# Altium schematic sheet HEATER.SchDoc: HEATER
size 420 x 297 mm; SheetNumber: 8; SheetTotal: 12
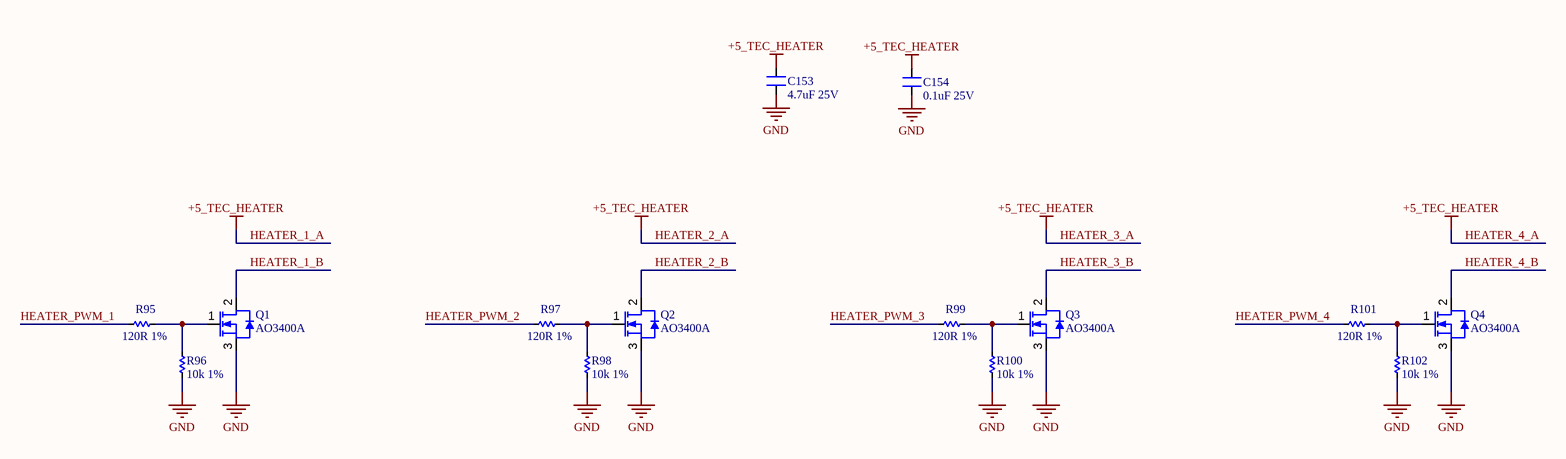
[diagram p0: HEATER.SchDoc]

## Parts
C153  4.7uF 25V  [CN-SMD-0603-EXP-V101]
C154  0.1uF 25V  [CN-SMD-0603-EXP-V101]
Q1  AO3400A  [SOT23-13_2]
Q2  AO3400A  [SOT23-13_2]
Q3  AO3400A  [SOT23-13_2]
Q4  AO3400A  [SOT23-13_2]
R95  120R 1%  [RES-SMD-0603-EXP-V101]
R96  10k 1%  [RES-SMD-0603-EXP-V101]
R97  120R 1%  [RES-SMD-0603-EXP-V101]
R98  10k 1%  [RES-SMD-0603-EXP-V101]
R99  120R 1%  [RES-SMD-0603-EXP-V101]
R100  10k 1%  [RES-SMD-0603-EXP-V101]
R101  120R 1%  [RES-SMD-0603-EXP-V101]
R102  10k 1%  [RES-SMD-0603-EXP-V101]

## Nets
GND: C153.1 C154.1 Q1.3(S) Q2.3(S) Q3.3(S) Q4.3(S) R96.1 R98.1 R100.1 R102.1
HEATER_1_A: C153.2 C154.2  [also labelled +5_TEC_HEATER, HEATER_2_A, HEATER_3_A, HEATER_4_A]
HEATER_1_B: Q1.2(D)
HEATER_2_B: Q2.2(D)
HEATER_3_B: Q3.2(D)
HEATER_4_B: Q4.2(D)
HEATER_PWM_1: R95.1
HEATER_PWM_2: R97.1
HEATER_PWM_3: R99.1
HEATER_PWM_4: R101.1
NetQ1_1: Q1.1(G) R95.2 R96.2
NetQ2_1: Q2.1(G) R97.2 R98.2
NetQ3_1: Q3.1(G) R99.2 R100.2
NetQ4_1: Q4.1(G) R101.2 R102.2

## Notes on the sheet
- Project:
- PEE-PC1
- Sub-system:
- NANORACK_EXP_CONTROLLER
- Design by:
- SANG HUYNH
- BAO BUI Q.
- Sheet title:
- Sheet
- A3
- of
- Checked by:
- Approved by:
- VU PHAM
- Revision:
- Document No:
- V1.0.0
- Size:
- Date:

## Library data of the parts
C153 C154 = Capacitors: Value: 33pF
Q1-Q4 = AO3400A: MOSFET N-CH 30V 5.7A SOT23-3L
R95-R102 = Res SMD: SMD; Manufacturer: Generic Components; Class: Passive; Published: 08/06/2000; Publisher: Altium Hobart Technology Centre